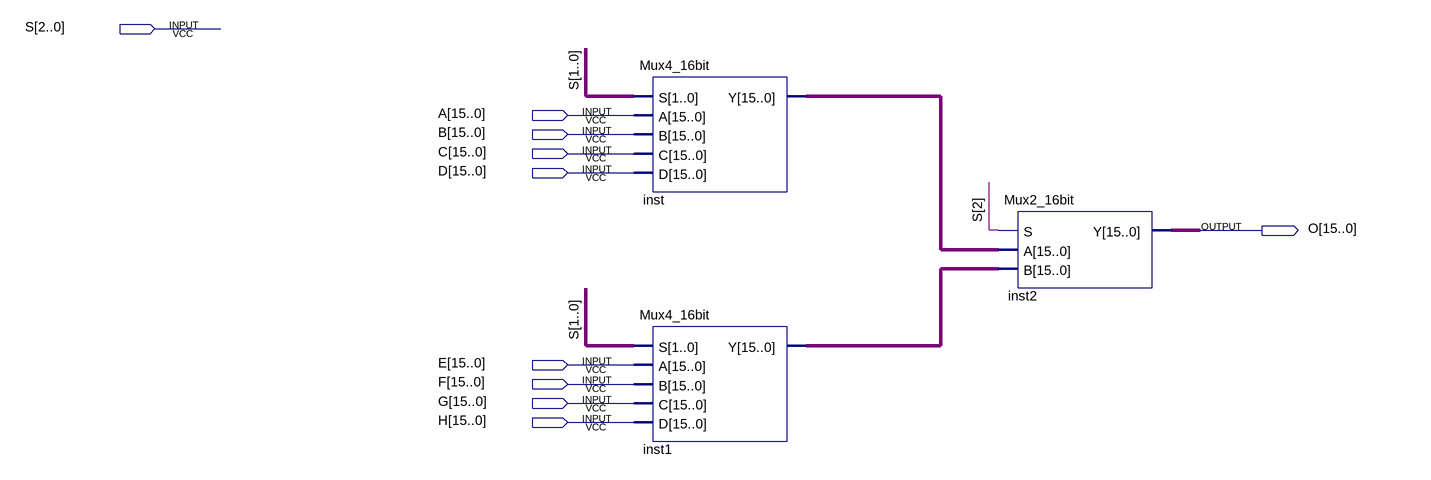
[diagram p0: schematic sheet]
// Quartus schematic mux8_16bit.bdf as structural Verilog: 3 symbols, 10 pins
module mux8_16bit (
  input  [2:0] S,
  input  [15:0] A,
  input  [15:0] B,
  input  [15:0] C,
  input  [15:0] D,
  input  [15:0] E,
  input  [15:0] F,
  input  [15:0] G,
  input  [15:0] H,
  output [15:0] O
);

  wire [15:0] inst1_y, inst_y;

  Mux4_16bit inst (.S(S[1:0]), .A(A), .B(B), .C(C), .D(D), .Y(inst_y));
  Mux4_16bit inst1 (.S(S[1:0]), .A(E), .B(F), .C(G), .D(H), .Y(inst1_y));
  Mux2_16bit inst2 (.S(S[2]), .A(inst_y), .B(inst1_y), .Y(O));
endmodule
